# Altium schematic sheet [13]-BACKUP_POWER.SchDoc
size A4
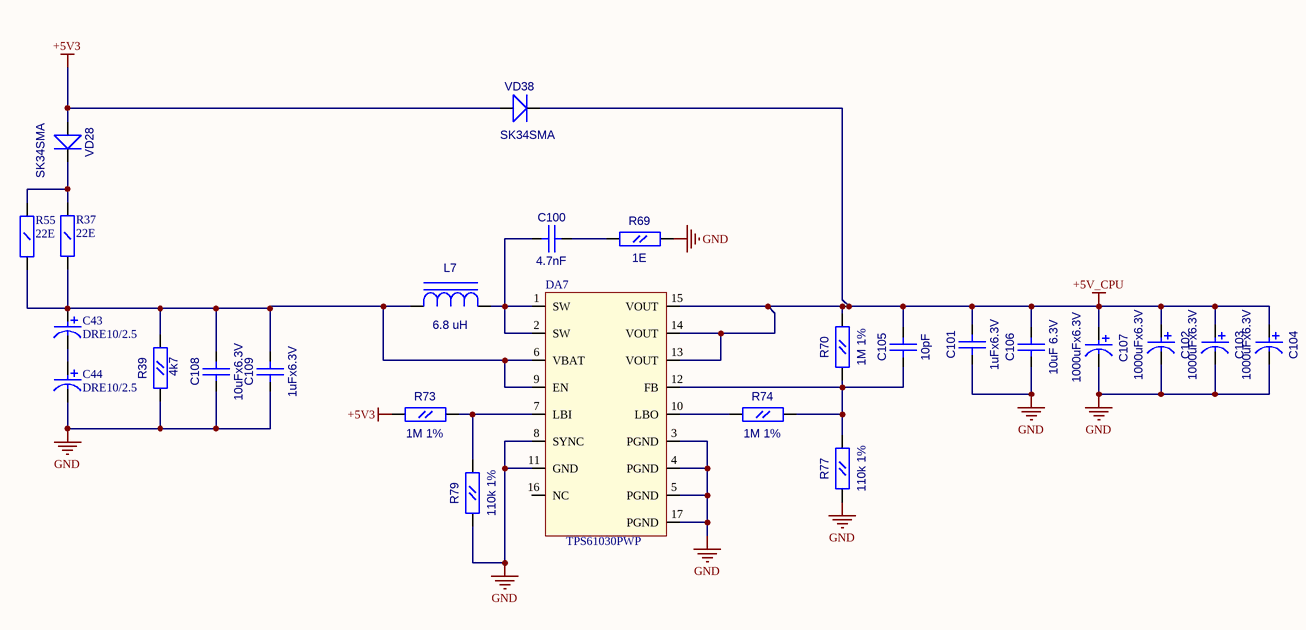
[diagram p0: [13]-BACKUP_POWER.SchDoc]

## Parts
C43  DRE10/2.5  [CAP16_26]
C44  DRE10/2.5  [CAP16_26]
C100  4.7nF  [CC0603]
C101  1uFx6.3V  [CC0603]
C102  value 1000uFx6.3V  [CC8X3.5]  (hidden comment: CAP0.35)
C103  value 1000uFx6.3V  [CC8X3.5]  (hidden comment: CAP0.35)
C104  value 1000uFx6.3V  [CC8X3.5]  (hidden comment: CAP0.35)
C105  10pF  [CC0603]
C106  10uF 6.3V  [CC0805]
C107  value 1000uFx6.3V  [CC8X3.5]  (hidden comment: CAP0.35)
C108  10uFx6.3V  [CC0805]
C109  1uFx6.3V  [CC0603]
DA7  TPS61030PWP  [R-PDSO-G16]
L7  6.8 uH  [SDR0805]
R37  22E  [R2512]
R39  4k7  [RC0603]
R55  22E  [R2512]
R69  1E  [RC0603]
R70  1M 1%  [RC0603]
R73  1M 1%  [RC0603]
R74  1M 1%  [RC0603]
R77  110k 1%  [RC0603]
R79  110k 1%  [RC0603]
VD28  SK34SMA  [SMA]
VD38  SK34SMA  [SMA]

## Nets
+5V3: R73.1(A) VD28.1(A) VD38.1(A)
+5V_CPU: C101.2(B) C102.1 C103.1 C104.1 C105.2(B) C106.2(B) C107.1 DA7.13(VOUT) DA7.14(VOUT) DA7.15(VOUT) R70.2(B) VD38.2(K)
GND: C44.1 C101.1(A) C102.2 C103.2 C104.2 C106.1(A) C107.2 C108.1(A) C109.1(A) DA7.3(PGND) DA7.4(PGND) DA7.5(PGND) DA7.8(SYNC) DA7.11(GND) DA7.17(PGND) R39.1(A) R69.2(B) R77.1(A) R79.1(A)
NetC43_1: C43.1 C44.2
NetC43_2: C43.2 C108.2(B) C109.2(B) DA7.6(VBAT) DA7.9(EN) L7.1(C) R37.1(A) R39.2(B) R55.1(A)
NetC100_1: C100.1(A) DA7.1(SW) DA7.2(SW) L7.2(A)
NetC100_2: C100.2(B) R69.1(A)
NetC105_1: C105.1(A) DA7.12(FB) R70.1(A) R74.2(B) R77.2(B)
NetDA7_7: DA7.7(LBI) R73.2(B) R79.2(B)
NetDA7_10: DA7.10(LBO) R74.1(A)
NetR37_2: R37.2(B) R55.2(B) VD28.2(K)

Not connected (* = marked no-connect by the designer): DA7 16(NC)

## Library data of the parts
C43 C44 = SUPERCAP_10F: Value: DRE10/2.5
C100 C101 C105 C109 = CC0603
  C100: Value: 4.7nF
  C101 C109: Value: 1uFx6.3V
  C105: Value: 10pF
C106 C108 = CC0805
  C106: Value: 10uF 6.3V
  C108: Value: 10uFx6.3V
DA7 = TPS61030PWP: Boost converter
L7 = SDR0805: Value: 6.8 uH
R37 R55 = RC2512: Resistor 2512 1W; Value: 22E
R39 R69 R70 R73 R74 R77 R79 = RC0603
  R39: Value: 4k7
  R69: Value: 1E
  R70 R73 R74: Value: 1M 1%
  R77 R79: Value: 110k 1%
VD28 VD38 = SK34SMA: Schottky Rectifier; Value: {Value}